# Altium schematic sheet iot_hdmi_mux.SchDoc
size A3; SheetNumber: 1; SheetTotal: 1
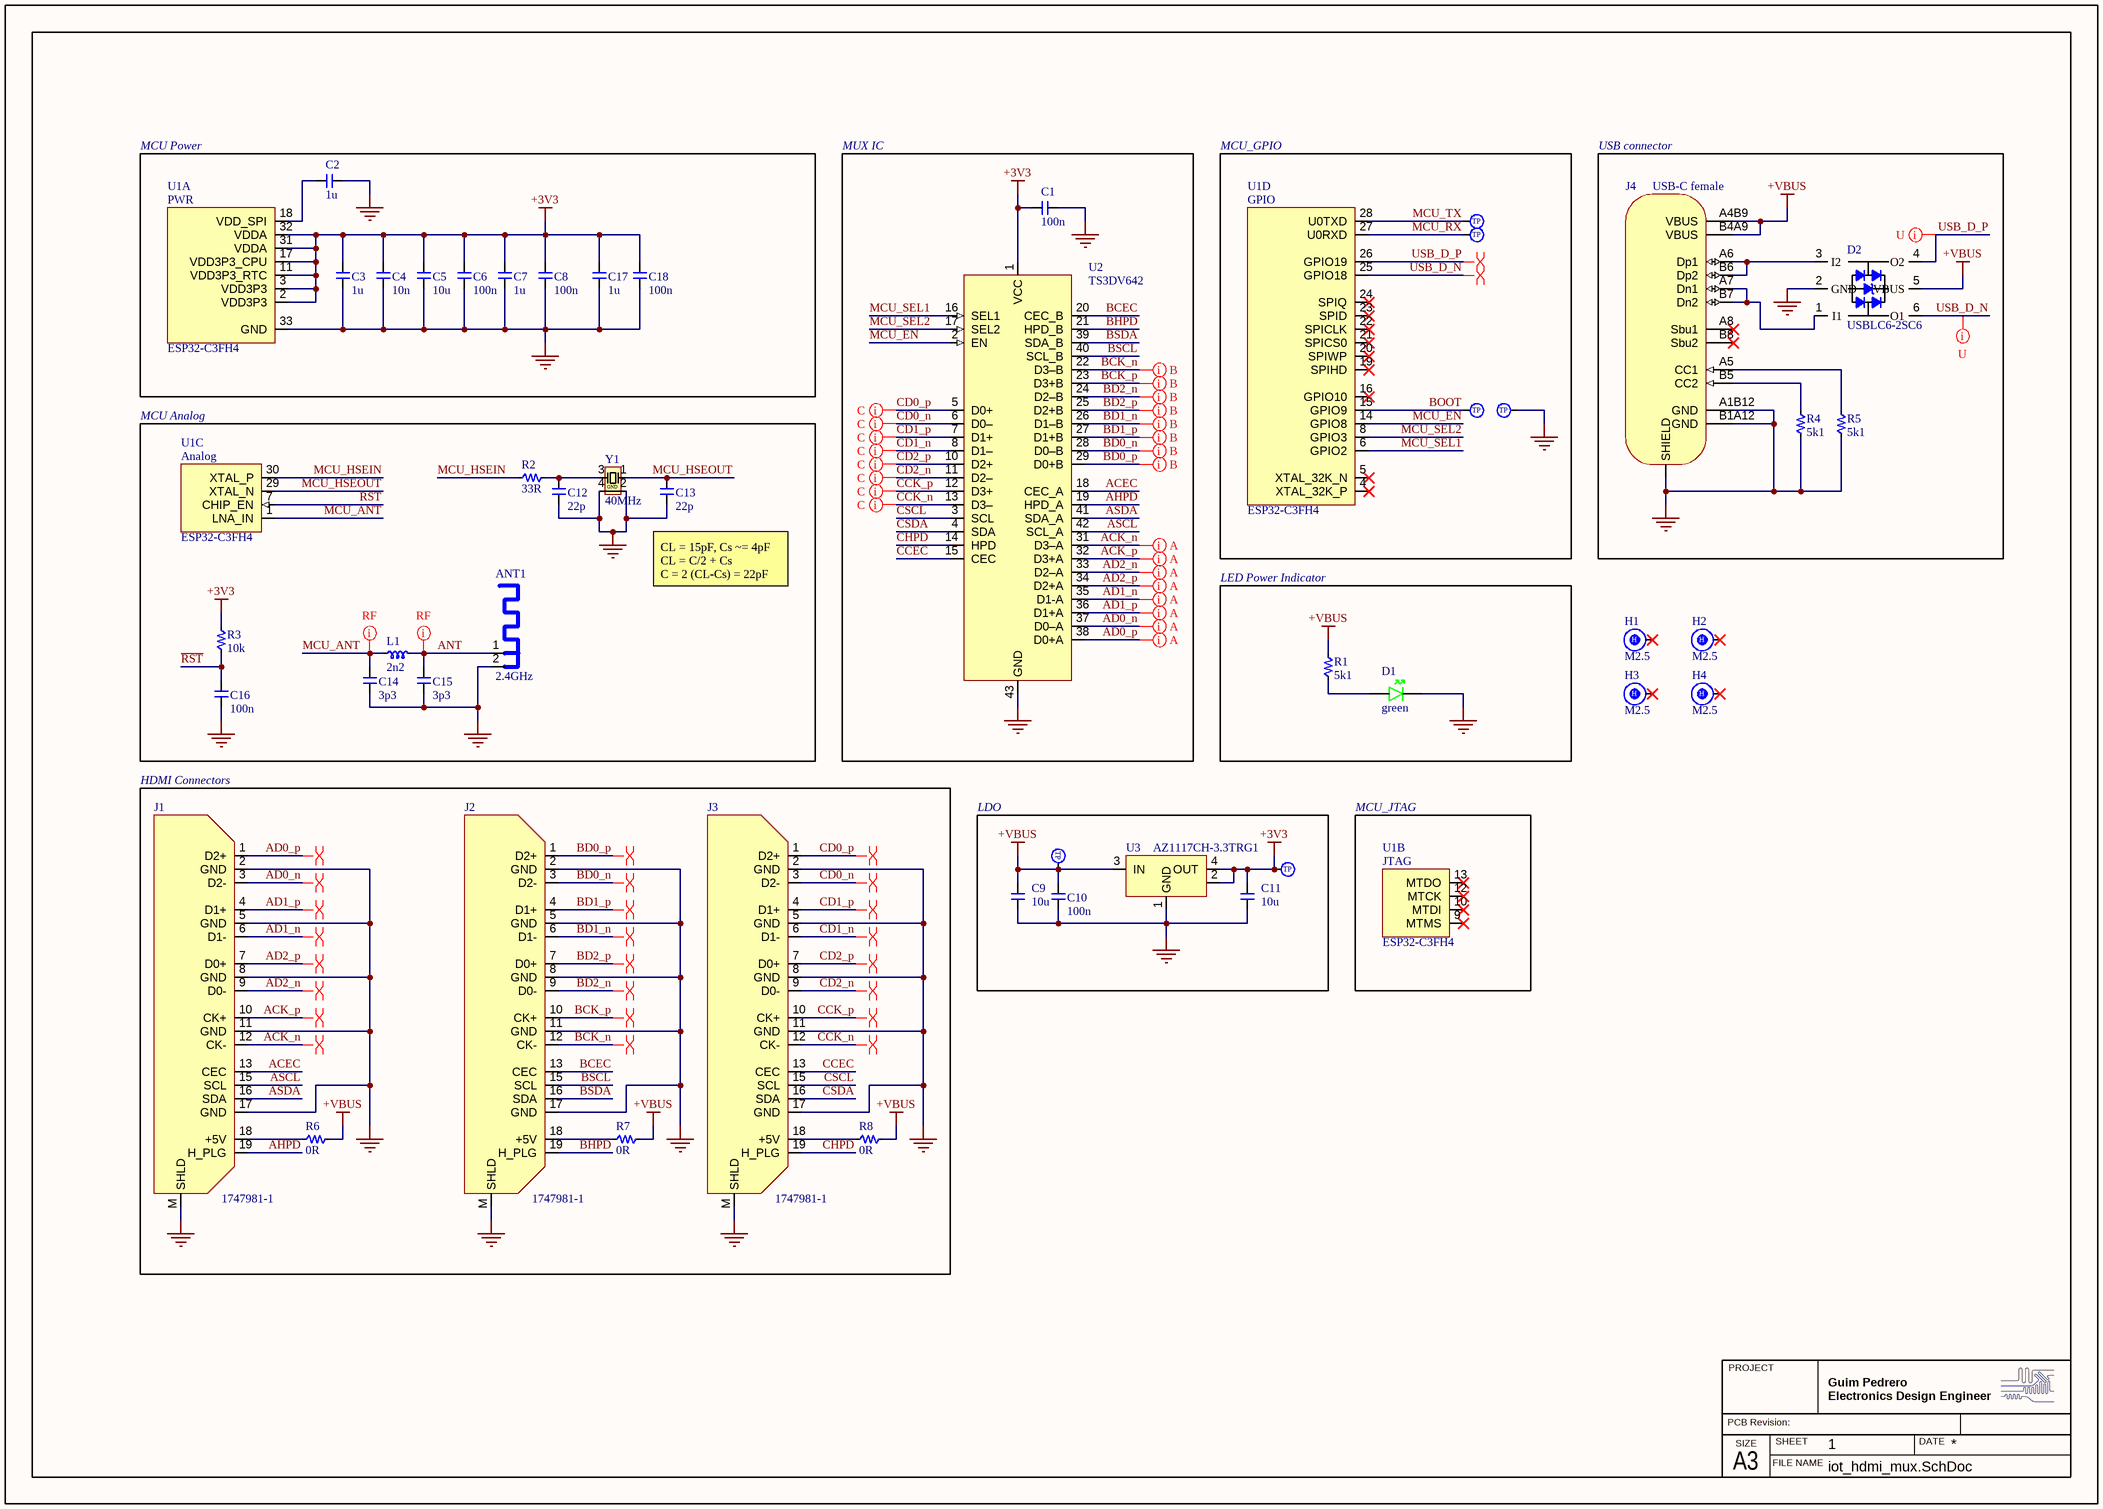
[diagram p0: iot_hdmi_mux.SchDoc]

## Parts
ANT1  2.4GHz  [ANT_2.4]  (net tie, no BOM)
C1  100n  [C0402]
C2  1u  [C0402]
C3  1u  [C0402]
C4  10n  [C0402]
C5  10u  [C0402]
C6  100n  [C0402]
C7  1u  [C0402]
C8  100n  [C0402]
C9  10u  [C0402]
C10  100n  [C0402]
C11  10u  [C0402]
C12  22p  [C0402]
C13  22p  [C0402]
C14  3p3  [C0402]
C15  3p3  [C0402]
C16  100n  [C0402]
C17  1u  [C0402]
C18  100n  [C0402]
D1  green  [LED_0805_G]
D2  USBLC6-2SC6  [USBLC6-2SC6]
H1  M2.5  [M2.5_HOLE]  (no BOM)
H2  M2.5  [M2.5_HOLE]  (no BOM)
H3  M2.5  [M2.5_HOLE]  (no BOM)
H4  M2.5  [M2.5_HOLE]  (no BOM)
J1  1747981-1  [1747981-1]
J2  1747981-1  [1747981-1]
J3  1747981-1  [1747981-1]
J4  USB-C female  [TYPE-C-31-M-12]
L1  2n2  [L0402]
R1  5k1  [R0402]
R2  33R  [R0402]
R3  10k  [R0402]
R4  5k1  [R0402]
R5  5k1  [R0402]
R6  0R  [R0402]
R7  0R  [R0402]
R8  0R  [R0402]
TP1  Testing_Point_1mm  [TestingPoint_1mm]  (value not drawn)  (no BOM)
TP2  Testing_Point_1mm  [TestingPoint_1mm]  (value not drawn)  (no BOM)
TP3  Testing_Point_1mm  [TestingPoint_1mm]  (value not drawn)  (no BOM)
TP4  Testing_Point_1mm  [TestingPoint_1mm]  (value not drawn)  (no BOM)
TP5  Testing_Point_1mm  [TestingPoint_1mm]  (value not drawn)  (no BOM)
TP6  Testing_Point_1mm  [TestingPoint_1mm]  (value not drawn)  (no BOM)
U1  ESP32-C3FH4  [QFN50P500X500X90_HS-33N]  (parts A,B,C,D of 4)
U2  TS3DV642  [QFN50P350X900X80_HS-43N]
U3  AZ1117CH-3.3TRG1  [AZ1117CH-3.3TRG1]
Y1  40MHz  [SMD3225-4P]

## Blocks framed on the sheet
MCU Power: C2-C8 C17 C18 U1
MUX IC: C1 U2
MCU_GPIO: TP1-TP4 U1
USB connector: D2 J4 R4 R5
MCU Analog: ANT1 C12-C16 L1 R2 R3 U1 Y1
LED Power Indicator: D1 R1
HDMI Connectors: J1-J3 R6-R8
LDO: C9-C11 TP5 TP6 U3
MCU_JTAG: U1

## Nets
+3V3: C1.2 C3.2 C4.1 C5.2 C6.1 C7.2 C8.1 C11.2 C17.2 C18.1 R3.2 TP6.1 U1.2(VDD3P3) U1.3(VDD3P3) U1.11(VDD3P3_RTC) U1.17(VDD3P3_CPU) U1.31(VDDA) U1.32(VDDA) U2.1(VCC) U3.2(OUT) U3.4(OUT)
+VBUS: C9.2 C10.1 D2.5(VBUS) J4.A4B9(VBUS) J4.B4A9(VBUS) R1.2 R6.1 R7.1 R8.1 TP5.1 U3.3(IN)
GND: ANT1.2 C1.1 C2.2 C3.1 C4.2 C5.1 C6.2 C7.1 C8.2 C9.1 C10.2 C11.1 C12.1 C13.1 C14.2 C15.2 C16.2 C17.1 C18.2 D1.1 D2.2(GND) J1.2(GND) J1.5(GND) J1.8(GND) J1.11(GND) J1.17(GND) J1.M(SHLD) J2.2(GND) J2.5(GND) J2.8(GND) J2.11(GND) J2.17(GND) J2.M(SHLD) J3.2(GND) J3.5(GND) J3.8(GND) J3.11(GND) J3.17(GND) J3.M(SHLD) J4.A1B12(GND) J4.B1A12(GND) J4.M1(SHIELD) R4.1 R5.1 TP4.1 U1.33(GND) U2.43(GND) U3.1(GND) Y1.2 Y1.4
ACEC: J1.13(CEC) U2.18(CEC_A)
ACK_n: J1.12(CK-) U2.31(D3–A)
ACK_p: J1.10(CK+) U2.32(D3+A)
AD0_n: J1.3(D2-) U2.37(D0–A)
AD0_p: J1.1(D2+) U2.38(D0+A)
AD1_n: J1.6(D1-) U2.35(D1-A)
AD1_p: J1.4(D1+) U2.36(D1+A)
AD2_n: J1.9(D0-) U2.33(D2–A)
AD2_p: J1.7(D0+) U2.34(D2+A)
AHPD: J1.19(H_PLG) U2.19(HPD_A)
ANT: ANT1.1 C15.1 L1.2
ASCL: J1.15(SCL) U2.42(SCL_A)
ASDA: J1.16(SDA) U2.41(SDA_A)
BCEC: J2.13(CEC) U2.20(CEC_B)
BCK_n: J2.12(CK-) U2.22(D3–B)
BCK_p: J2.10(CK+) U2.23(D3+B)
BD0_n: J2.3(D2-) U2.28(D0–B)
BD0_p: J2.1(D2+) U2.29(D0+B)
BD1_n: J2.6(D1-) U2.26(D1–B)
BD1_p: J2.4(D1+) U2.27(D1+B)
BD2_n: J2.9(D0-) U2.24(D2–B)
BD2_p: J2.7(D0+) U2.25(D2+B)
BHPD: J2.19(H_PLG) U2.21(HPD_B)
BOOT: TP3.1 U1.15(GPIO9)
BSCL: J2.15(SCL) U2.40(SCL_B)
BSDA: J2.16(SDA) U2.39(SDA_B)
CCEC: J3.13(CEC) U2.15(CEC)
CCK_n: J3.12(CK-) U2.13(D3–)
CCK_p: J3.10(CK+) U2.12(D3+)
CD0_n: J3.3(D2-) U2.6(D0–)
CD0_p: J3.1(D2+) U2.5(D0+)
CD1_n: J3.6(D1-) U2.8(D1–)
CD1_p: J3.4(D1+) U2.7(D1+)
CD2_n: J3.9(D0-) U2.11(D2–)
CD2_p: J3.7(D0+) U2.10(D2+)
CHPD: J3.19(H_PLG) U2.14(HPD)
CSCL: J3.15(SCL) U2.3(SCL)
CSDA: J3.16(SDA) U2.4(SDA)
MCU_ANT: C14.1 L1.1 U1.1(LNA_IN)
MCU_EN: U1.14(GPIO8) U2.2(EN)
MCU_HSEIN: R2.1 U1.30(XTAL_P)
MCU_HSEOUT: C13.2 U1.29(XTAL_N) Y1.1
MCU_RX: TP2.1 U1.27(U0RXD)
MCU_SEL1: U1.6(GPIO2) U2.16(SEL1)
MCU_SEL2: U1.8(GPIO3) U2.17(SEL2)
MCU_TX: TP1.1 U1.28(U0TXD)
~{RST}: C16.1 R3.1 U1.7(CHIP_EN)
USB_D_N: D2.6(O1) U1.25(GPIO18)
USB_D_P: D2.4(O2) U1.26(GPIO19)
NetC2_1: C2.1 U1.18(VDD_SPI)
NetC12_2: C12.2 R2.2 Y1.3
NetD1_2: D1.2 R1.1
NetD2_1: D2.1(I1) J4.A7(Dn1) J4.B7(Dn2)
NetD2_3: D2.3(I2) J4.A6(Dp1) J4.B6(Dp2)
NetJ1_18: J1.18(+5V) R6.2
NetJ2_18: J2.18(+5V) R7.2
NetJ3_18: J3.18(+5V) R8.2
NetJ4_A5: J4.A5(CC1) R5.2
NetJ4_B5: J4.B5(CC2) R4.2

Not connected (* = marked no-connect by the designer): H1 1*; H2 1*; H3 1*; H4 1*; J4 A8(Sbu1)* B8(Sbu2)*; U1 4(XTAL_32K_P)* 5(XTAL_32K_N)* 9(MTMS)* 10(MTDI)* 12(MTCK)* 13(MTDO)* 16(GPIO10)* 19(SPIHD)* 20(SPIWP)* 21(SPICS0)* 22(SPICLK)* 23(SPID)* 24(SPIQ)*

## Layout directives
differential pair: ACK_n, ACK_p, AD0_n, AD0_p, AD1_n, AD1_p, AD2_n, AD2_p, BCK_n, BCK_p, BD0_n, BD0_p, BD1_n, BD1_p, BD2_n, BD2_p, CCK_n, CCK_p, CD0_n, CD0_p, CD1_n, CD1_p, CD2_n, CD2_p, USB_D_N, USB_D_P
net class RF: ANT, MCU_ANT
net class HDMI_C: CCK_n, CCK_p, CD0_n, CD0_p, CD1_n, CD1_p, CD2_n, CD2_p
net class HDMI_B: BCK_n, BCK_p, BD0_n, BD0_p, BD1_n, BD1_p, BD2_n, BD2_p
net class HDMI_A: ACK_n, ACK_p, AD0_n, AD0_p, AD1_n, AD1_p, AD2_n, AD2_p
net class USB: USB_D_N, USB_D_P

## Notes on the sheet
- CL = 15pF, Cs ~= 4pF
  CL = C/2 + Cs
  C = 2 (CL-Cs) = 22pF
- PROJECT
- PCB Revision:
- SIZE
- FILE NAME
- SHEET
- Guim Pedrero
  Electronics Design Engineer
- DATE
- A3
- (in symbol ESP32-C3FH4, part A) PWR
- (in symbol ESP32-C3FH4, part B) JTAG
- (in symbol ESP32-C3FH4, part C) Analog
- (in symbol ESP32-C3FH4, part D) GPIO
- (in symbol M2.5_HOLE) H
- (in symbol Testing_Point_1mm) TP
- (in symbol X322540MPB4SI) GND

## Library data of the parts
ANT1 = ANT_2.4: SWRA117D 2.4GHz antenna design by TI
C1-C18 = C_0402: 0402 cap
  C1 C6 C8 C10 C16 C18: LCSC: C307331
  C2 C3 C7 C17: LCSC: C52923
  C4: LCSC: C15195
  C5 C9 C11: LCSC: C15525
  C12 C13: LCSC: C1555
  C14 C15: LCSC: C1565
D1 = LED_0805_G: 0805 green LED; LCSC: C2297
D2 = USBLC6-2SC6: Trans Voltage Suppressor Diode, 5V V(RWM), Unidirectional, 1 Element, Silicon; Manufacturer: STMicroelectronics; Package Body Material: Plastic; Additional Feature: HIGH RELIABILITY; Min Breakdown Voltage: 6V; Number of Elements: 1; Clamping Voltage-Max: 17V; Reference Standard: IEC-61000-4-2; Qualification Status: Not Qualified; Supplier 1: Mouser; Manufacturer Part Number: USBLC6-2SC6; RoHS: Yes; Category: TVS Diodes; Stock 1: 162692; Pricing 1: 1=0.61, 10=0.522, 50=0.522, 100=0.375, 1000=0.258, 10000=0.204 (USD); Pins: 6; Package Shape: Rectangular; Terminal Finish: Tin; Diode Element Material: SILICON; Min Operating Temperature: -40°C; Max Operating Temperature: 125°C; JESD-609 Code: e3; Polarity: Unidirectional; Package Style: SMALL OUTLINEMeter; Diode Type: TRANS VOLTAGE SUPPRESSOR; JESD-30 Code: R-PDSO-G6; Moisture Sensitivity Level: 1; Rep Pk Reverse Voltage-Max: 5V; Surface Mount: Yes; Technology: AVALANCHE; Terminal Form: Gull Wing; Terminal Position: DUAL; Peak Reflow Temperature (Cel): 260°C; Reach SVHC Compliant: Yes; RoHS Compliant: Yes; ComponentLink1URL: https://datasheet.ciiva.com:443/pdfs/VipMasterIC/IC/SGST/SGSTS30336/SGSTS30336-1.pdf?src-supplier=IHS+Markit; ComponentLink1Description: https://datasheet.ciiva.com:443/pdfs/VipMasterIC/IC/SGST/SGSTS30336/SGSTS30336-1.pdf?src-supplier=IHS+Markit; ComponentLink2URL: https://datasheet.ciiva.com/1268/1690354-1268384.pdf?src-supplier=Element14; ComponentLink2Description: https://datasheet.ciiva.com/1268/1690354-1268384.pdf?src-supplier=Element14; ComponentLink3URL: https://datasheet.ciiva.com/4508/cd00050750-113117-4508433.pdf?src-supplier=Mouser; ComponentLink3Description: https://datasheet.ciiva.com/4508/cd00050750-113117-4508433.pdf?src-supplier=Mouser; ComponentLink4URL: https://datasheet.ciiva.com/15143/getdatasheetpartid-148465-15143789.pdf?src-supplier=Verical; ComponentLink4Description: https://datasheet.ciiva.com/15143/getdatasheetpartid-148465-15143789.pdf?src-supplier=Verical; ComponentLink5URL: https://datasheet.ciiva.com/16200/cd00050750-16200026.pdf?src-supplier=Future+Electronics; ComponentLink5Description: https://datasheet.ciiva.com/16200/cd00050750-16200026.pdf?src-supplier=Future+Electronics; ComponentLink6URL: https://datasheet.ciiva.com/41444/001184109-da-01-en-ic-esd-protecti-usblc6-2sc6-sot-23-6-stm-41444156.pdf?src-supplier=Conrad; ComponentLink6Description: https://datasheet.ciiva.com/41444/001184109-da-01-en-ic-esd-protecti-usblc6-2sc6-sot-23-6-stm-41444156.pdf?src-supplier=Conrad; Supplier Part Number 1: 511-USBLC6-2SC6; LCSC: C2827654
H1-H4 = M2.5_HOLE: M2.5 hole with connection
J1-J3 = 1747981-1: HDMI (High-Definition Multimedia Interface) Connector; No Flange; Through hole; Manufacturer: AMP - TE CONNECTIVITY; Supplier: Allied Electronics; Supplier Part Number: 70084303; Manufacturer Part Number: 1747981-1; RoHS: No; ComponentLink1URL: http://www.farnell.com/datasheets/596170.pdf?src-supplier=Farnell; ComponentLink1Description: http://www.farnell.com/datasheets/596170.pdf?src-supplier=Farnell; ComponentLink2URL: https://www.te.com/commerce/DocumentDelivery/DDEController?Action=srchrtrv&DocNm=1747981&DocType=Customer+Drawing&DocLang=English&src-supplier=Digikey; ComponentLink2Description: https://www.te.com/commerce/DocumentDelivery/DDEController?Action=srchrtrv&DocNm=1747981&DocType=Customer+Drawing&DocLang=English&src-supplier=Digikey; ComponentLink3URL: http://www.farnell.com/datasheets/596170.pdf?src-supplier=Newark; ComponentLink3Description: http://www.farnell.com/datasheets/596170.pdf?src-supplier=Newark; LCSC: C428484
J4 = TYPE-C-31-M-12: Conn USB Type C PL 22 POS 0.5mm Solder ST SMD 22 Terminal 1Port Emboss T/R; Manufacturer: HRO Electronics; Supplier 1: LCSC; Manufacturer Part Number: TYPE-C-31-M-12; RoHS: No; Category: Uncategorized; Stock 1: 6920; Pricing 1: 5=0.1612, 50=0.1282, 150=0.112, 1000=0.0977, 2000=0.0937, 5000=0.0913 (USD); Supplier Part Number 1: C165948; LCSC: C165948
L1 = L_0402: 0402 inductor; LCSC: C86061
R1-R8 = R_0402: 0402 62.5mW
  R1 R4 R5: LCSC: C25905
  R2: LCSC: C25105
  R3: LCSC: C25744
  R6-R8: LCSC: C17168
TP1-TP6 = Testing_Point_1mm: 1mm testing point
U1 = ESP32-C3FH4: RF System on a Chip - SoC SMD IC ESP32-C3FH4, single-core MCU, 2.4G Wi-Fi & BLE 5.0 combo, QFN 32-pin, 5*5 mm, 4 MB flash inside, -40 C - +105 C; Manufacturer: Espressif Systems; Supplier: Mouser; Supplier Part Number: 356-ESP32-C3FH4; Manufacturer Part Number: ESP32-C3FH4; RoHS: No; Category: LDO; Stock: 8425; Pricing: 1=1.3, 10=1.3, 50=1.3, 100=1.3, 1000=1.3, 10000=1.3 (USD); LCSC: C2858491
U2 = TS3DV642: 6-Gbps 12-channel differential 1-to-2 and 2-to-1 mux for DVI 1.0/ DisplayPort 1.4 /HDMI 2.0; Manufacturer: Texas Instruments; Manufacturer Part Number: TS3DV642A0RUAR; Package Body Material: Plastic; Consumer IC Type: CONSUMER CIRCUIT; Channels: 1; Max Supply Voltage: 4.5V; Min Supply Voltage: 2.6V; Supplier: Mouser; Supplier Part Number: 595-TS3DV642A0RUAR; RoHS: Yes; Category: Decoders and Multiplexers; Stock: 5076; Pricing: 1=1.49, 10=0.988, 50=0.988, 100=0.878, 1000=0.767, 10000=0.725 (USD); Case/Package: HVQCCN; Pins: 42; Package Shape: Rectangular; Terminal Finish: Nickel; Min Operating Temperature: -40°C; Max Operating Temperature: 85°C; JESD-609 Code: e4; Moisture Sensitivity Level: 3; Package Style: CHIP CARRIER, HEAT SINK/SLUG, VERY THIN PROFILEMeter; Peak Reflow Temperature (Cel): 260°C; Surface Mount: Yes; Terminal Form: No Lead; Terminal Position: QUAD; Length: 9mm; Width: 3.5mm; Height - Seated (Max): 0.8mm; Terminal Pitch: 0.5mm; RoHS Compliant: Yes; Temperature Grade: INDUSTRIAL; Reach SVHC Compliant: Yes; ComponentLink1URL: https://www.ti.com:443/lit/ds/symlink/ts3dv642.pdf?src-supplier=IHS+Markit; ComponentLink1Description: https://www.ti.com:443/lit/ds/symlink/ts3dv642.pdf?src-supplier=IHS+Markit; ComponentLink2URL: https://datasheet.ciiva.com/30004/ts3dv642-30004934.pdf?src-supplier=Avnet; ComponentLink2Description: https://datasheet.ciiva.com/30004/ts3dv642-30004934.pdf?src-supplier=Avnet; ComponentLink3URL: https://datasheet.ciiva.com/18576/ts3dv642-18576654.pdf?src-supplier=Digikey; ComponentLink3Description: https://datasheet.ciiva.com/18576/ts3dv642-18576654.pdf?src-supplier=Digikey; LCSC: C157482
U3 = AZ1117CH-3.3TRG1: Fixed Positive LDO Regulator, 3.3V, 1.3V Dropout, BIPolar, PDSO3; Manufacturer: Diodes; Package Body Material: Plastic; Dropout Voltage1-Nom: 1.2V; Input Voltage Absolute-Max: 18V; Max Supply Voltage: 15V; Line Regulation-Max: 0.01%; Load Regulation-Max: 0.015%; Channels: 1; Output Current1-Max: 800mA; Output Voltage1-Max: 3.365V; Output Voltage1-Min: 3.235V; Regulator Type: FIXED POSITIVE SINGLE OUTPUT LDO REGULATOR; Voltage Tolerance-Max: 1.97%; Qualification Status: Not Qualified; Supplier 1: Future Electronics; Manufacturer Part Number: AZ1117CH-3.3TRG1; RoHS: Yes; Category: Voltage Regulators - Linear; Stock 1: 820000; Pricing 1: 4000=0.0702, 16000=0.0672, 40000=0.0653, 100000=0.0634, 160000=0.0607 (USD); Case/Package: SOP; Pins: 3; Package Shape: Rectangular; Terminal Finish: Tin; JESD-609 Code: e3; Adjustability: FIXED; Dropout Voltage1-Max: 1.3V; JESD-30 Code: R-PDSO-G3; Moisture Sensitivity Level: 1; Number of Outputs: 1; Operating Temperature, TJ-Max: 125°C; Operating Temperature, TJ-Min: -20°C; Output Voltage1-Nom: 3.3V; Package Style: SMALL OUTLINEMeter; Packaging: Tape and Reel; Surface Mount: Yes; Technology: BIPOLAR; Terminal Form: Gull Wing; Terminal Position: DUAL; Length: 6.5mm; Width: 3.5mm; Terminal Pitch: 2.3mm; Height - Seated (Max): 1.8mm; Reach SVHC Compliant: Yes; RoHS Compliant: Yes; ComponentLink1URL: https://datasheet.ciiva.com:443/pdfs/VipMasterIC/IC/DIOD/DIOD-S-A0007713706/DIOD-S-A0007713706-1.pdf?src-supplier=IHS+Markit; ComponentLink1Description: https://datasheet.ciiva.com:443/pdfs/VipMasterIC/IC/DIOD/DIOD-S-A0007713706/DIOD-S-A0007713706-1.pdf?src-supplier=IHS+Markit; ComponentLink2URL: https://datasheet.ciiva.com/29569/az1117c-29569914.pdf?src-supplier=Digi-Key; ComponentLink2Description: https://datasheet.ciiva.com/29569/az1117c-29569914.pdf?src-supplier=Digi-Key; ComponentLink3URL: https://datasheet.ciiva.com/29569/az1117c-29569915.pdf?src-supplier=Digi-Key; ComponentLink3Description: https://datasheet.ciiva.com/29569/az1117c-29569915.pdf?src-supplier=Digi-Key; ComponentLink4URL: https://datasheet.ciiva.com/29569/az1117c-29569913.pdf?src-supplier=Digi-Key; ComponentLink4Description: https://datasheet.ciiva.com/29569/az1117c-29569913.pdf?src-supplier=Digi-Key; Supplier Part Number 1: 6047233; LCSC: C92102
Y1 = X322540MPB4SI: 40MHz Surface Mount Crystal 15pF ±10ppm ±20ppm SMD3225-4P Crystals ROHS; LCSC: C9010